# Altium schematic sheet PM12_Power.SchDoc: FIT_PM12 board
size 420 x 297 mm; CheckedBy: G.Kasprowicz; Author: INR Moscow; CompanyName: WUT ISE; DrawnBy: M.Podgórski; Organization: WUT ISE; Address1: PW ISE; Address2: Nowowiejska 15/19 00-665 Warsaw; Address3: gkasprow@gmail.com; DocumentNumber: 11; Revision: 2; SheetNumber: 13; SheetTotal: 34; ModifiedBy: -; CheckedDate: -; Title2: PSU subsystem; DivGrp: WUT ISE; Designer: INR RAS; ModifiedDate: -; ProjectName: Sensor Box
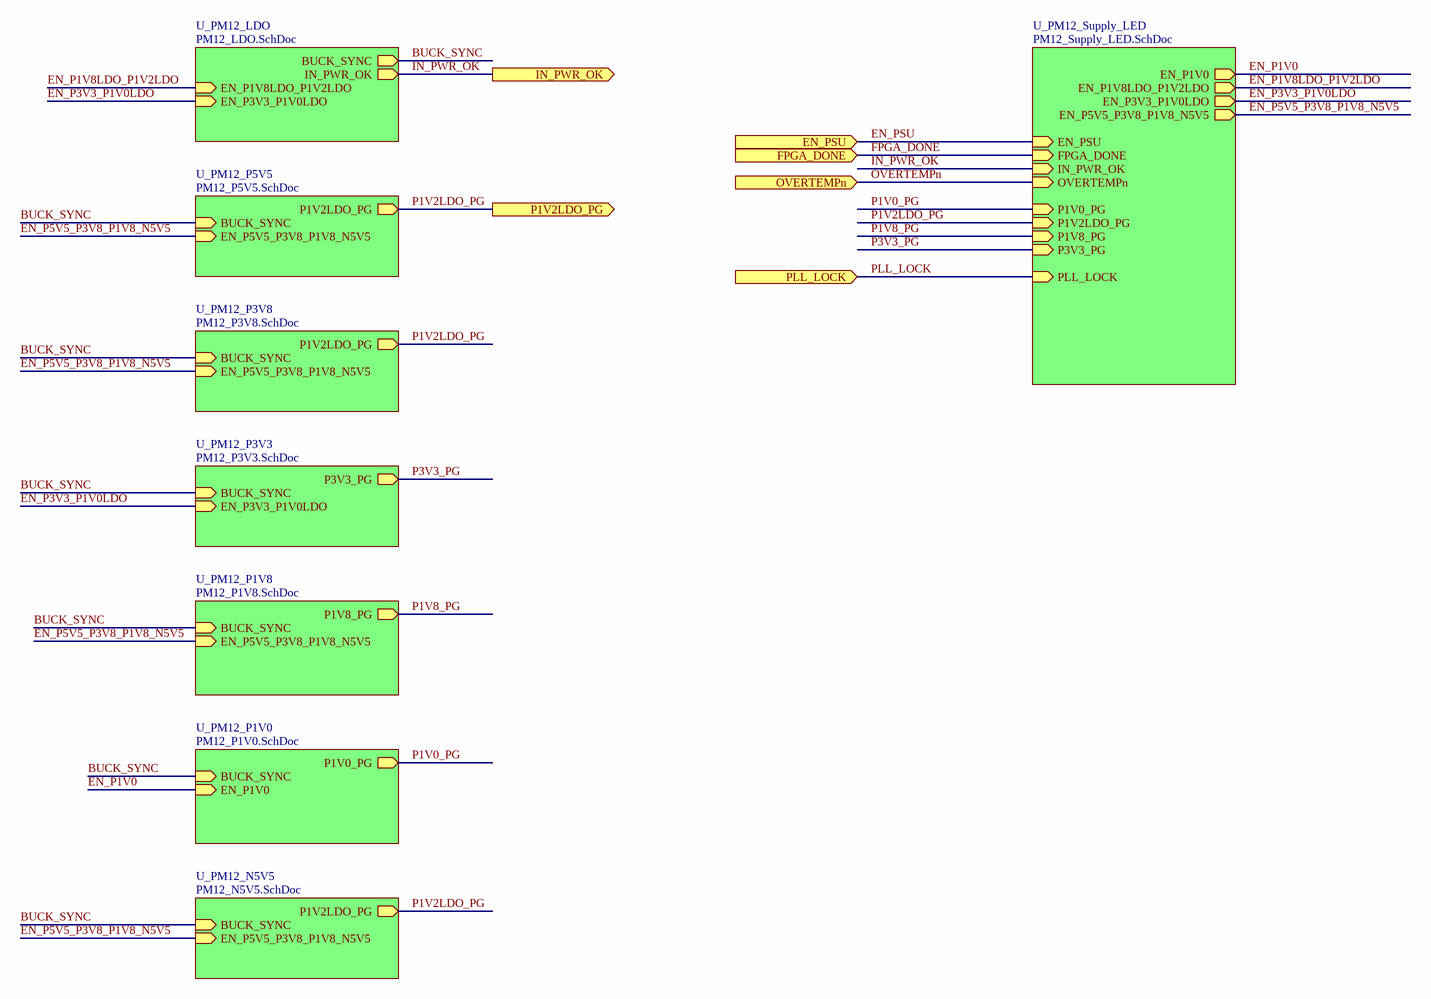
[diagram p0: PM12_Power.SchDoc]

## Sub-sheets
U_PM12_LDO = PM12_LDO.SchDoc: IN_PWR_OK (out), BUCK_SYNC (out), EN_P3V3_P1V0LDO (in), EN_P1V8LDO_P1V2LDO (in)
U_PM12_N5V5 = PM12_N5V5.SchDoc: BUCK_SYNC (in), EN_P5V5_P3V8_P1V8_N5V5 (in), P1V2LDO_PG (out)
U_PM12_P1V0 = PM12_P1V0.SchDoc: BUCK_SYNC (in), EN_P1V0 (in), P1V0_PG (out)
U_PM12_P1V8 = PM12_P1V8.SchDoc: BUCK_SYNC (in), EN_P5V5_P3V8_P1V8_N5V5 (in), P1V8_PG (out)
U_PM12_P3V3 = PM12_P3V3.SchDoc: BUCK_SYNC (in), EN_P3V3_P1V0LDO (in), P3V3_PG (out)
U_PM12_P3V8 = PM12_P3V8.SchDoc: BUCK_SYNC (in), EN_P5V5_P3V8_P1V8_N5V5 (in), P1V2LDO_PG (out)
U_PM12_P5V5 = PM12_P5V5.SchDoc: BUCK_SYNC (in), EN_P5V5_P3V8_P1V8_N5V5 (in), P1V2LDO_PG (out)
U_PM12_Supply_LED = PM12_Supply_LED.SchDoc: IN_PWR_OK (in), EN_P3V3_P1V0LDO (out), EN_P1V8LDO_P1V2LDO (out), FPGA_DONE (in), PLL_LOCK (in), EN_PSU (in), EN_P1V0 (out), EN_P5V5_P3V8_P1V8_N5V5 (out), P1V0_PG (in), P3V3_PG (in), P1V8_PG (in), P1V2LDO_PG (in), OVERTEMPn (in)

## Ports
EN_PSU (in), FPGA_DONE (in), IN_PWR_OK (out), OVERTEMPn (in), P1V2LDO_PG (out), PLL_LOCK (in)

## Nets
BUCK_SYNC: sheet U_PM12_LDO/BUCK_SYNC, sheet U_PM12_P3V8/BUCK_SYNC, sheet U_PM12_P3V3/BUCK_SYNC, sheet U_PM12_N5V5/BUCK_SYNC, sheet U_PM12_P5V5/BUCK_SYNC, sheet U_PM12_P1V0/BUCK_SYNC, sheet U_PM12_P1V8/BUCK_SYNC
EN_P1V0: sheet U_PM12_Supply_LED/EN_P1V0, sheet U_PM12_P1V0/EN_P1V0
EN_P1V8LDO_P1V2LDO: sheet U_PM12_LDO/EN_P1V8LDO_P1V2LDO, sheet U_PM12_Supply_LED/EN_P1V8LDO_P1V2LDO
EN_P3V3_P1V0LDO: sheet U_PM12_LDO/EN_P3V3_P1V0LDO, sheet U_PM12_Supply_LED/EN_P3V3_P1V0LDO, sheet U_PM12_P3V3/EN_P3V3_P1V0LDO
EN_P5V5_P3V8_P1V8_N5V5: sheet U_PM12_Supply_LED/EN_P5V5_P3V8_P1V8_N5V5, sheet U_PM12_P3V8/EN_P5V5_P3V8_P1V8_N5V5, sheet U_PM12_N5V5/EN_P5V5_P3V8_P1V8_N5V5, sheet U_PM12_P5V5/EN_P5V5_P3V8_P1V8_N5V5, sheet U_PM12_P1V8/EN_P5V5_P3V8_P1V8_N5V5
EN_PSU: port EN_PSU, sheet U_PM12_Supply_LED/EN_PSU
FPGA_DONE: port FPGA_DONE, sheet U_PM12_Supply_LED/FPGA_DONE
IN_PWR_OK: port IN_PWR_OK, sheet U_PM12_LDO/IN_PWR_OK, sheet U_PM12_Supply_LED/IN_PWR_OK
OVERTEMPn: port OVERTEMPn, sheet U_PM12_Supply_LED/OVERTEMPn
P1V0_PG: sheet U_PM12_Supply_LED/P1V0_PG, sheet U_PM12_P1V0/P1V0_PG
P1V2LDO_PG: port P1V2LDO_PG, sheet U_PM12_Supply_LED/P1V2LDO_PG, sheet U_PM12_P3V8/P1V2LDO_PG, sheet U_PM12_N5V5/P1V2LDO_PG, sheet U_PM12_P5V5/P1V2LDO_PG
P1V8_PG: sheet U_PM12_Supply_LED/P1V8_PG, sheet U_PM12_P1V8/P1V8_PG
P3V3_PG: sheet U_PM12_Supply_LED/P3V3_PG, sheet U_PM12_P3V3/P3V3_PG
PLL_LOCK: port PLL_LOCK, sheet U_PM12_Supply_LED/PLL_LOCK

## Notes on the sheet
- Project/Equipment
- Document
- Designer
- Drawn by
- Check.by
- Copyright WUT ISE 2024.
  This documentation describes Open Hardware and is licensed under the CERN OHL v.2. You may redistribute and modify this documentation under the terms of the CERN OHL v.2. (http://ohwr.org/CERNOHL). This documentation is distributed WITHOUT ANY EXPRESS OR IMPLIED WARRANTY, INCLUDING OF MERCHANTABILITY, SATISFACTORY QUALITY AND FITNESS FOR A PARTICULAR PURPOSE. Please see the CERN OHL v.2 for applicable conditions.
- Contact
- File
- Last Mod.
- Print Date
- Sheet
- Size
- A3
- of
- Rev